# Altium schematic sheet ST-LINK.SchDoc: RespiraWorks
size A3; CompanyName: RespiraWorks; DrawnBy: E. Chiu; Organization: Altium; DocumentNumber: 4; Revision: A1; SheetNumber: 4; SheetTotal: 8; PageSetup: Record=PageOptions|CenterHorizontal=True|CenterVertical=True|PrintScale=0.67|XCorrection=1.00|YCorrection=1.00|PrintKind=0|BorderSize=5000000|LeftOffset=0|BottomOffset=0|Orientation=2|PaperLength=1000|PaperWidth=1000|Scale=100|PaperSource=276|PrintQuality=-3|MediaType=1|DitherType=10|PrintScaleMode=1|PaperKind=11"x17" 279.4x431.8mm|PaperIndex=3; ProjectName: FALCON 3S
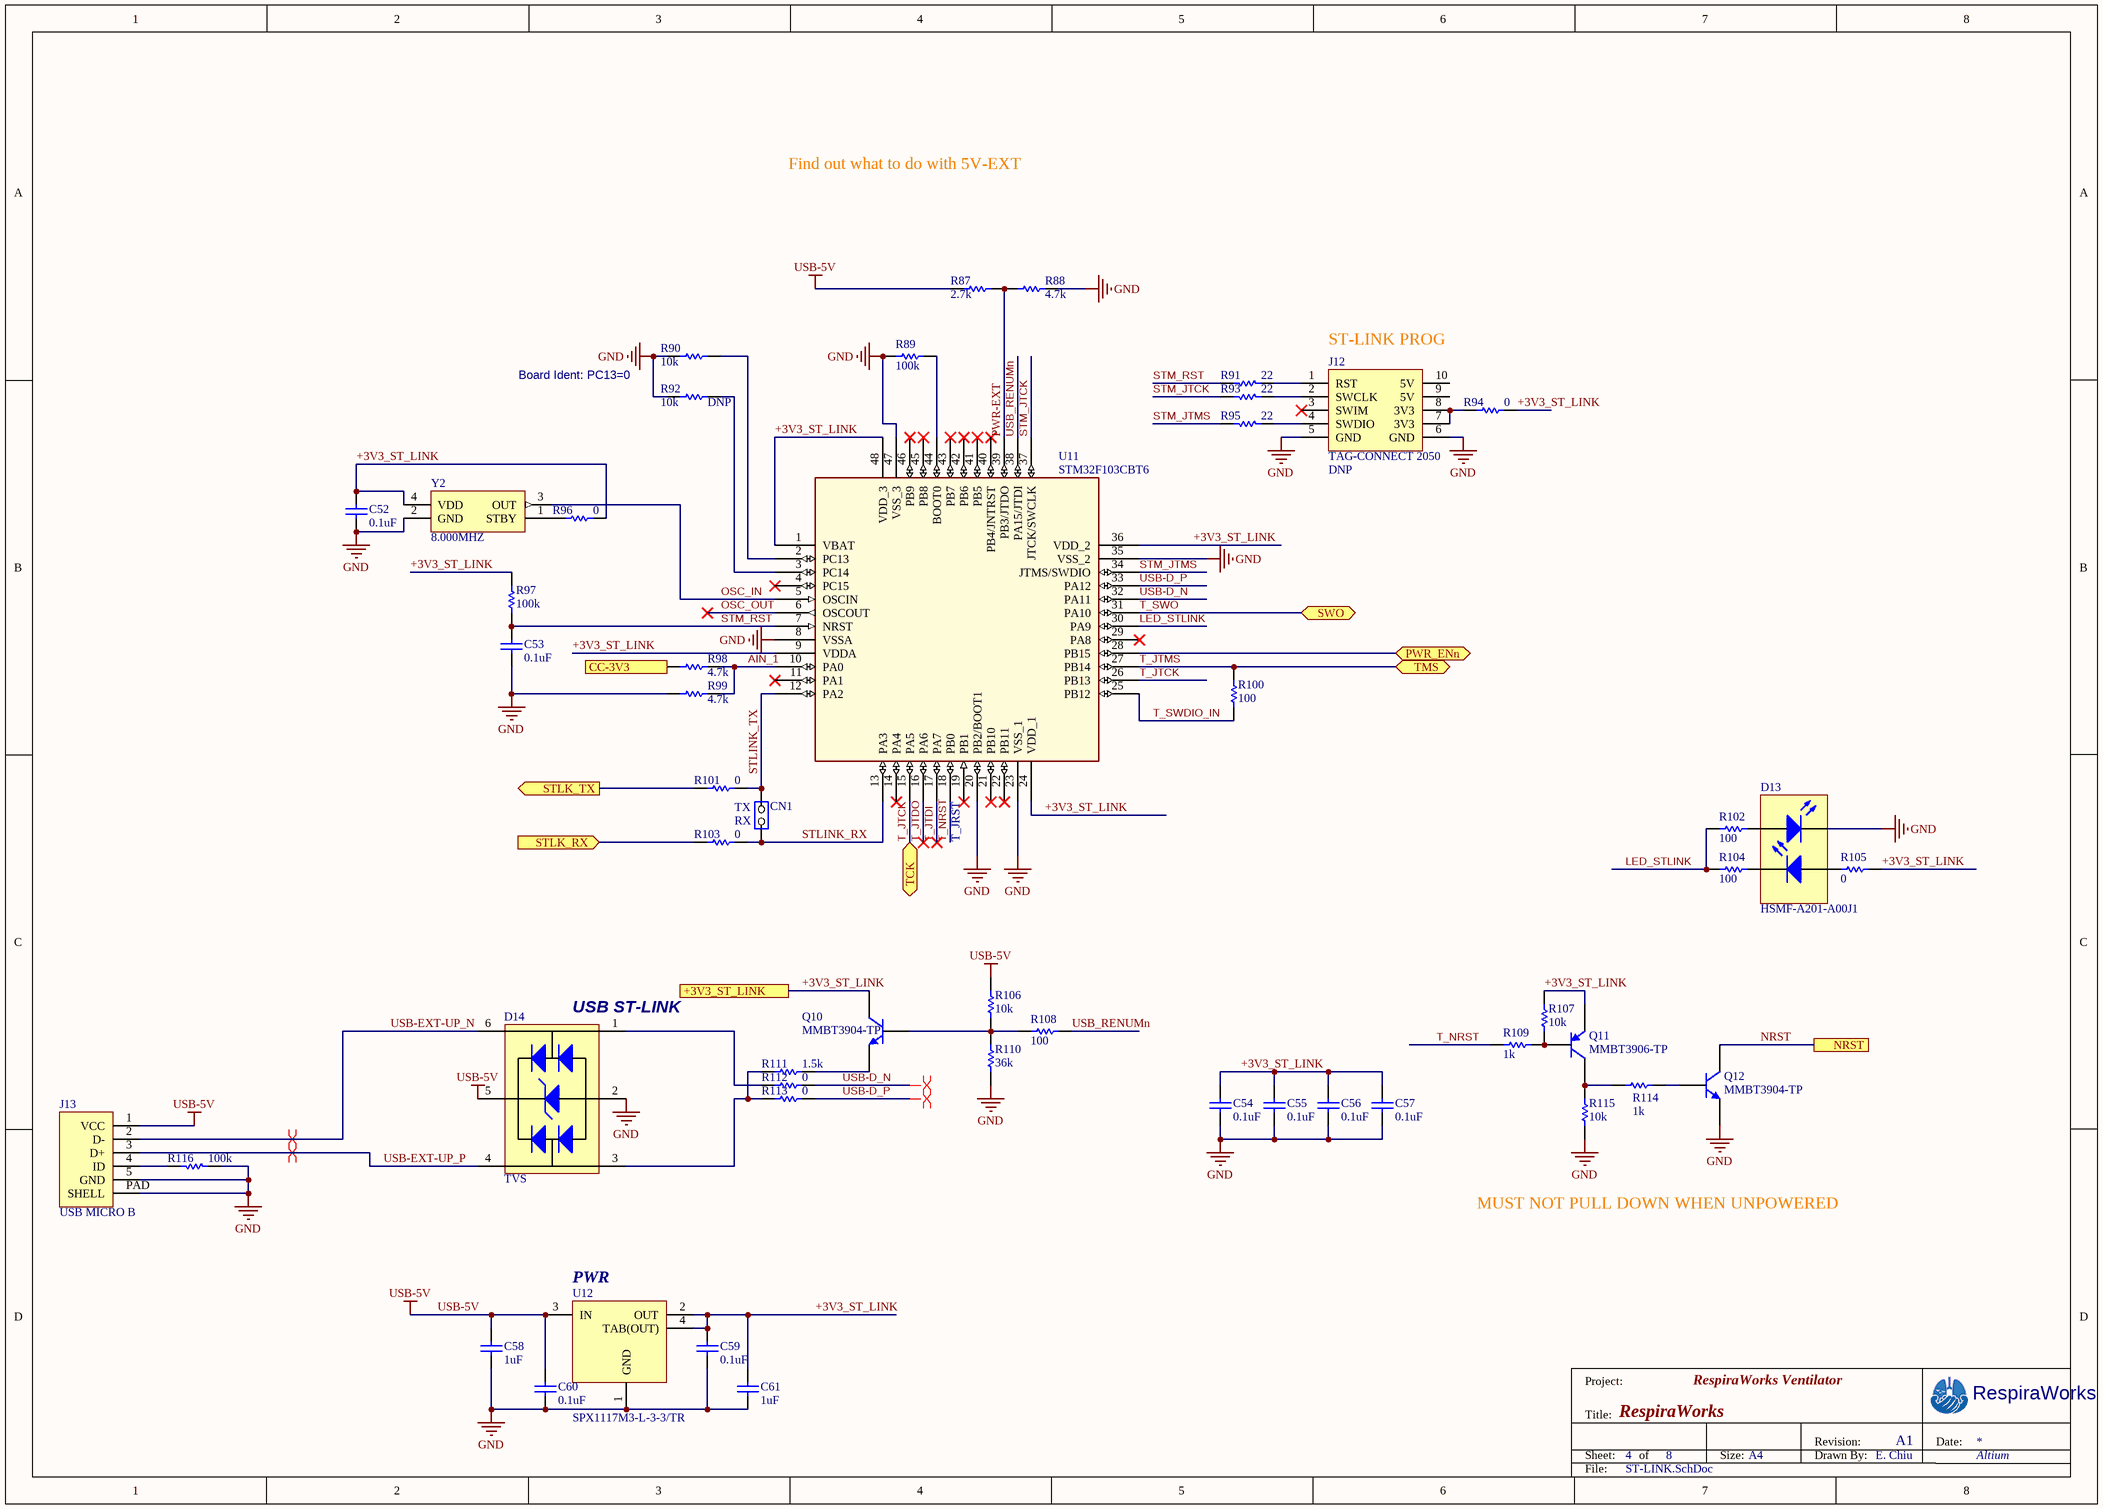
[diagram p0: ST-LINK.SchDoc]

## Parts
C52  value 0.1uF  [CAP0603]  (hidden comment: CAP 0603)
C53  value 0.1uF  [CAP0603]  (hidden comment: CAP 0603)
C54  value 0.1uF  [CAP0603]  (hidden comment: CAP 0603)
C55  value 0.1uF  [CAP0603]  (hidden comment: CAP 0603)
C56  value 0.1uF  [CAP0603]  (hidden comment: CAP 0603)
C57  value 0.1uF  [CAP0603]  (hidden comment: CAP 0603)
C58  value 1uF  [CAP0603]  (hidden comment: CAP 0603)
C59  value 0.1uF  [CAP0603]  (hidden comment: CAP 0603)
C60  value 0.1uF  [CAP0603]  (hidden comment: CAP 0603)
C61  value 1uF  [CAP0603]  (hidden comment: CAP 0603)
CN1  (no value)  [HDR1X2]
D13  Manufacturer P/N: HSMF-A201-A00J1  [4-LED3228]  (hidden comment: *)
D14  TVS  [6-SOT23]
J12  TAG-CONNECT 2050  Do Not Populate: DNP  [TAG-CONNECT-2050]
J13  USB MICRO B  [10118192-0001LF]
Q10  Manufacturer P/N: MMBT3904-TP  [3-SOT23]  (hidden comment: MMBT3904)
Q11  Manufacturer P/N: MMBT3906-TP  [3-SOT23]  (hidden comment: MMBT3906)
Q12  Manufacturer P/N: MMBT3904-TP  [3-SOT23]  (hidden comment: MMBT3904)
R87  value 2.7k  [RES0603]  (hidden comment: RES 0603)
R88  value 4.7k  [RES0603]  (hidden comment: RES 0603)
R89  value 100k  [RES0603]  (hidden comment: RES 0603)
R90  value 10k  [RES0603]  (hidden comment: RES 0603)
R91  value 22  [RES0603]  (hidden comment: RES 0603)
R92  value 10k  Do Not Populate: DNP  [RES0603]  (hidden comment: RES 0603)
R93  value 22  [RES0603]  (hidden comment: RES 0603)
R94  value 0  [RES0603]  (hidden comment: RES 0603)
R95  value 22  [RES0603]  (hidden comment: RES 0603)
R96  value 0  [RES0603]  (hidden comment: RES 0603)
R97  value 100k  [RES0603]  (hidden comment: RES 0603)
R98  value 4.7k  [RES0603]  (hidden comment: RES 0603)
R99  value 4.7k  [RES0603]  (hidden comment: RES 0603)
R100  value 100  [RES0603]  (hidden comment: RES 0603)
R101  value 0  [RES0603]  (hidden comment: RES 0603)
R102  value 100  [RES0603]  (hidden comment: RES 0603)
R103  value 0  [RES0603]  (hidden comment: RES 0603)
R104  value 100  [RES0603]  (hidden comment: RES 0603)
R105  value 0  [RES0603]  (hidden comment: RES 0603)
R106  value 10k  [RES0603]  (hidden comment: RES 0603)
R107  value 10k  [RES0603]  (hidden comment: RES 0603)
R108  value 100  [RES0603]  (hidden comment: RES 0603)
R109  value 1k  [RES0603]  (hidden comment: RES 0603)
R110  value 36k  [RES0603]  (hidden comment: RES 0603)
R111  value 1.5k  [RES0603]  (hidden comment: RES 0603)
R112  value 0  [RES0603]  (hidden comment: RES 0603)
R113  value 0  [RES0603]  (hidden comment: RES 0603)
R114  value 1k  [RES0603]  (hidden comment: RES 0603)
R115  value 10k  [RES0603]  (hidden comment: RES 0603)
R116  value 100k  [RES0603]  (hidden comment: RES 0603)
U11  STM32F103CBT6  [48-LQFP]
U12  Manufacturer P/N: SPX1117M3-L-3-3/TR  [3-SOT223]  (hidden comment: NCP1117ST33T3G)
Y2  8.000MHZ  [4-OSC3225]

## Ports
+3V3_ST_LINK, CC-3V3, NRST, PWR_ENn (bidir), STLK_RX (in), STLK_TX (out), SWO (bidir), TCK (bidir), TMS (bidir)

## Nets
GND: C52.1 C53.1 C54.1 C55.1 C56.1 C57.1 C58.1 C59.1 C60.1 C61.1 D13.1(K1) D14.2(GND) J12.5(GND) J12.6(GND) J13.5(GND) J13.PAD(SHELL) Q12.2(E) R88.2 R89.2 R90.2 R92.2 R99.1 R110.1 R115.2 R116.1 U11.8(VSSA) U11.20(PB2/BOOT1) U11.23(VSS_1) U11.35(VSS_2) U11.47(VSS_3) U12.1(GND) Y2.2(GND)
USB-5V: C58.2 C60.2 D14.5(VBUS) J13.1(VCC) R87.1 R106.2 U12.3(IN)
+3V3_ST_LINK: C52.2 C54.2 C55.2 C56.2 C57.2 C59.2 C61.2 Q10.3(C) Q11.2(E) R94.2 R96.1 R97.2 R105.2 R107.1 U11.1(VBAT) U11.9(VDDA) U11.24(VDD_1) U11.36(VDD_2) U11.48(VDD_3) U12.2(OUT) U12.4(TAB(OUT)) Y2.4(VDD) ; port +3V3_ST_LINK
AIN_1: R98.2 R99.2 U11.10(PA0)
CC-3V3: R98.1 ; port CC-3V3
LED_STLINK: R102.1 R104.1 U11.30(PA9)
NRST: Q12.3(C) ; port NRST
OSC_IN: U11.5(OSCIN) Y2.3(OUT)
OSC_OUT: U11.6(OSCOUT)
PWR-EXT: R87.2 R88.1 U11.39(PB3/JTDO)
PWR_ENn: U11.28(PB15) ; port PWR_ENn
STLINK_RX: CN1.1(COMMON) R103.2 U11.13(PA3)
STLINK_TX: CN1.2(NO) R101.2 U11.12(PA2)
STLK_RX: R103.1 ; port STLK_RX
STLK_TX: R101.1 ; port STLK_TX
STM_JTCK: R93.2 U11.37(JTCK/SWCLK)
STM_JTMS: R95.2 U11.34(JTMS/SWDIO)
STM_RST: C53.2 R91.2 R97.1 U11.7(NRST)
T_JTCK: U11.15(PA5) U11.26(PB13) ; port TCK
T_JTDI: U11.17(PA7)
T_JTDO: U11.16(PA6)
T_JTMS: R100.2 U11.27(PB14) ; port TMS
T_NRST: R109.2 U11.18(PB0)
T_SWDIO_IN: R100.1 U11.25(PB12)
T_SWO: U11.31(PA10) ; port SWO
USB-D_N: R112.2 U11.32(PA11)
USB-D_P: R113.2 U11.33(PA12)
USB-EXT-UP_N: D14.6(IO1) J13.2(D-)
USB-EXT-UP_P: D14.4(IO3) J13.3(D+)
USB_RENUMn: R108.1 U11.38(PA15/JTDI)
NetD13_2: D13.2(A1) R102.2
NetD13_3: D13.3(K2) R104.2
NetD13_4: D13.4(A2) R105.1
NetD14_1: D14.1(IO1) R112.1
NetD14_3: D14.3(IO2) R111.2 R113.1
NetJ12_1: J12.1(RST) R91.1
NetJ12_2: J12.2(SWCLK) R93.1
NetJ12_4: J12.4(SWDIO) R95.1
NetJ12_7: J12.7(3V3) J12.8(3V3) R94.1
NetJ13_4: J13.4(ID) R116.2
NetQ10_1: Q10.1(B) R106.1 R108.2 R110.2
NetQ10_2: Q10.2(E) R111.1
NetQ11_1: Q11.1(B) R107.2 R109.1
NetQ11_3: Q11.3(C) R114.2 R115.1
NetQ12_1: Q12.1(B) R114.1
NetR89_1: R89.1 U11.44(BOOT0)
NetR90_1: R90.1 U11.2(PC13)
NetR92_1: R92.1 U11.3(PC14)
NetR96_2: R96.2 Y2.1(STBY)

Not connected (* = marked no-connect by the designer): J12 3(SWIM)* 9(5V) 10(5V); U11 4(PC15)* 11(PA1)* 14(PA4)* 19(PB1)* 21(PB10)* 22(PB11)* 29(PA8)* 40(PB4/JNTRST)* 41(PB5)* 42(PB6)* 43(PB7)* 45(PB8)* 46(PB9)*

## Layout directives
differential pair: USB-D_N, USB-D_P, USB-EXT-UP_N, USB-EXT-UP_P

## Notes on the sheet
- Find out what to do with 5V-EXT
- Board Ident: PC13=0
- (near J12) ST-LINK PROG
- TX
- RX
- (near U11) T_JRST
- (near D14) USB ST-LINK
- MUST NOT PULL DOWN WHEN UNPOWERED
- (near U12) PWR
- Project:
- RespiraWorks Ventilator
- Title:
- Sheet:
- of
- Size:
- A4
- Drawn By:
- Revision:
- Date:
- File:

## Library data of the parts
C52-C57 C59 C60 = CAP 0603: Manufacturer P/N: CC0603KRX7R8BB104; Manufacturer: Yageo; Voltage: 25V; PCB Package: 0603; Type: X7R; Do Not Populate: *
C58 C61 = CAP 0603: Manufacturer P/N: C1608X5R1E105K080AC; Manufacturer: TDK; Voltage: 25V; PCB Package: 0603; Type: X5R; Do Not Populate: *
CN1 = JP2: HEADER 2; Manufacturer P/N: 61300211121; Manufacturer: Wurth; Fitted: NO
D13 = LED 3228 4PIN: LED 3528 4PIN; Manufacturer: Broadcom; PCB Package: 4-LED3528; Color: Red/Green; Vf: 2.2V; Intensity: 20mcd; Do Not Populate: *; Value: *
D14 = USBLC6-2SC6: TVS, USB2.0, 15kV; Manufacturer: ST Micro; PCB Package: SOT23-6; If(max): 20A; Vf(max): 1.1V; Manufacturer P/N: USBLC6-2SC6; Do Not Populate: *; Vr(max): 15kV
J12 = TC-2050-STLINK: 10-pin TAG-CONNECT Bed of Nails footprint; Manufacturer P/N: *; Manufacturer: *; PCB Package: *; Tolerance: *; Value: *
J13 = 10118192-0001LF: SMT USB MICRO B RECEPTACLE; Manufacturer: Amphenol; Manufacturer P/N: 10118192-0001LF; PCB Package: *; Tolerance: *; Do Not Populate: *; Value: *
Q10 Q12 = MMBT3904: Transistor, BJT NPN, General Purpose 40V; Manufacturer: Micro Commercial; PCB Package: SOT23; Ic(max): 200mA; Vce(max): 40V
Q11 = MMBT3906: Transistor, BJT PNP, General Purpose 40V; Manufacturer: Micro Commercial; PCB Package: SOT23; Ic(max): 200mA; Vce(max): 40V
R87 = RES 0603: Manufacturer P/N: ERJ-3EKF2701V; Manufacturer: Panasonic; PCB Package: 0603; Tolerance: 1%; Do Not Populate: *
R88 R98 R99 = RES 0603: Manufacturer P/N: AC0603FR-074K7L; Manufacturer: Yageo; PCB Package: 0603; Tolerance: 1%; Do Not Populate: *
R89 R97 R116 = RES 0603: Manufacturer P/N: ERJ-3EKF1003V; Manufacturer: Panasonic; PCB Package: 0603; Tolerance: 1%; Do Not Populate: *
R90 R92 R106 R107 R115 = RES 0603: Manufacturer P/N: ERJ-3EKF1002V; Manufacturer: Panasonic; PCB Package: 0603; Tolerance: *
  R90 R106 R107 R115: Do Not Populate: *
R91 R93 R95 = RES 0603: Manufacturer P/N: RC0603FR-0722RL; Manufacturer: Yageo; PCB Package: 0603; Tolerance: 1%; Do Not Populate: *
R94 R96 R101 R103 R105 R112 R113 = RES 0603: Manufacturer P/N: ERJ-3GEY0R00V; Manufacturer: Panasonic; PCB Package: 0603; Tolerance: *; Do Not Populate: *
R100 R102 R104 R108 = RES 0603: Manufacturer P/N: AC0603FR-07100RL; Manufacturer: Yageo; PCB Package: 0603; Tolerance: 1%; Do Not Populate: *
R109 R114 = RES 0603: Manufacturer P/N: AC0603FR-071KL; Manufacturer: Yageo; PCB Package: 0603; Tolerance: 1%; Do Not Populate: *
R110 = RES 0603: Manufacturer P/N: RC0603FR-0736KL; Manufacturer: Yageo; PCB Package: 0603; Tolerance: 1%; Do Not Populate: *
R111 = RES 0603: Manufacturer P/N: RC0603FR-071K5L; Manufacturer: Yageo; PCB Package: 0603; Tolerance: 1%; Do Not Populate: *
U11 = STM32F103CBT6: Medium-density performance line ARM-based 32-bit MCU with 64KB Flash; Manufacturer: ST Micro; Manufacturer P/N: STM32F103CBT6; PCB Package: 48-LQFP
U12 = NCP1117ST33T3G: LDO, 3.3V out, 1A, 20V in, SOT-223, 0.8W Pd max; Manufacturer: Exar; PCB Package: SOT223; Do Not Populate: *
Y2 = ASEMB-8.000MHZ-LC-T: OSC MEMS 8.000MHZ CMOS SMD; Manufacturer: Abracon; PCB Package: 3225; Tolerance: 50ppm; Manufacturer P/N: ASEMB-8.000MHZ-LC-T; Do Not Populate: *; Value: 8.000MHZ